# EAGLE design item_2022_Frontend_02_V7 (EAGLE 7.7.0)
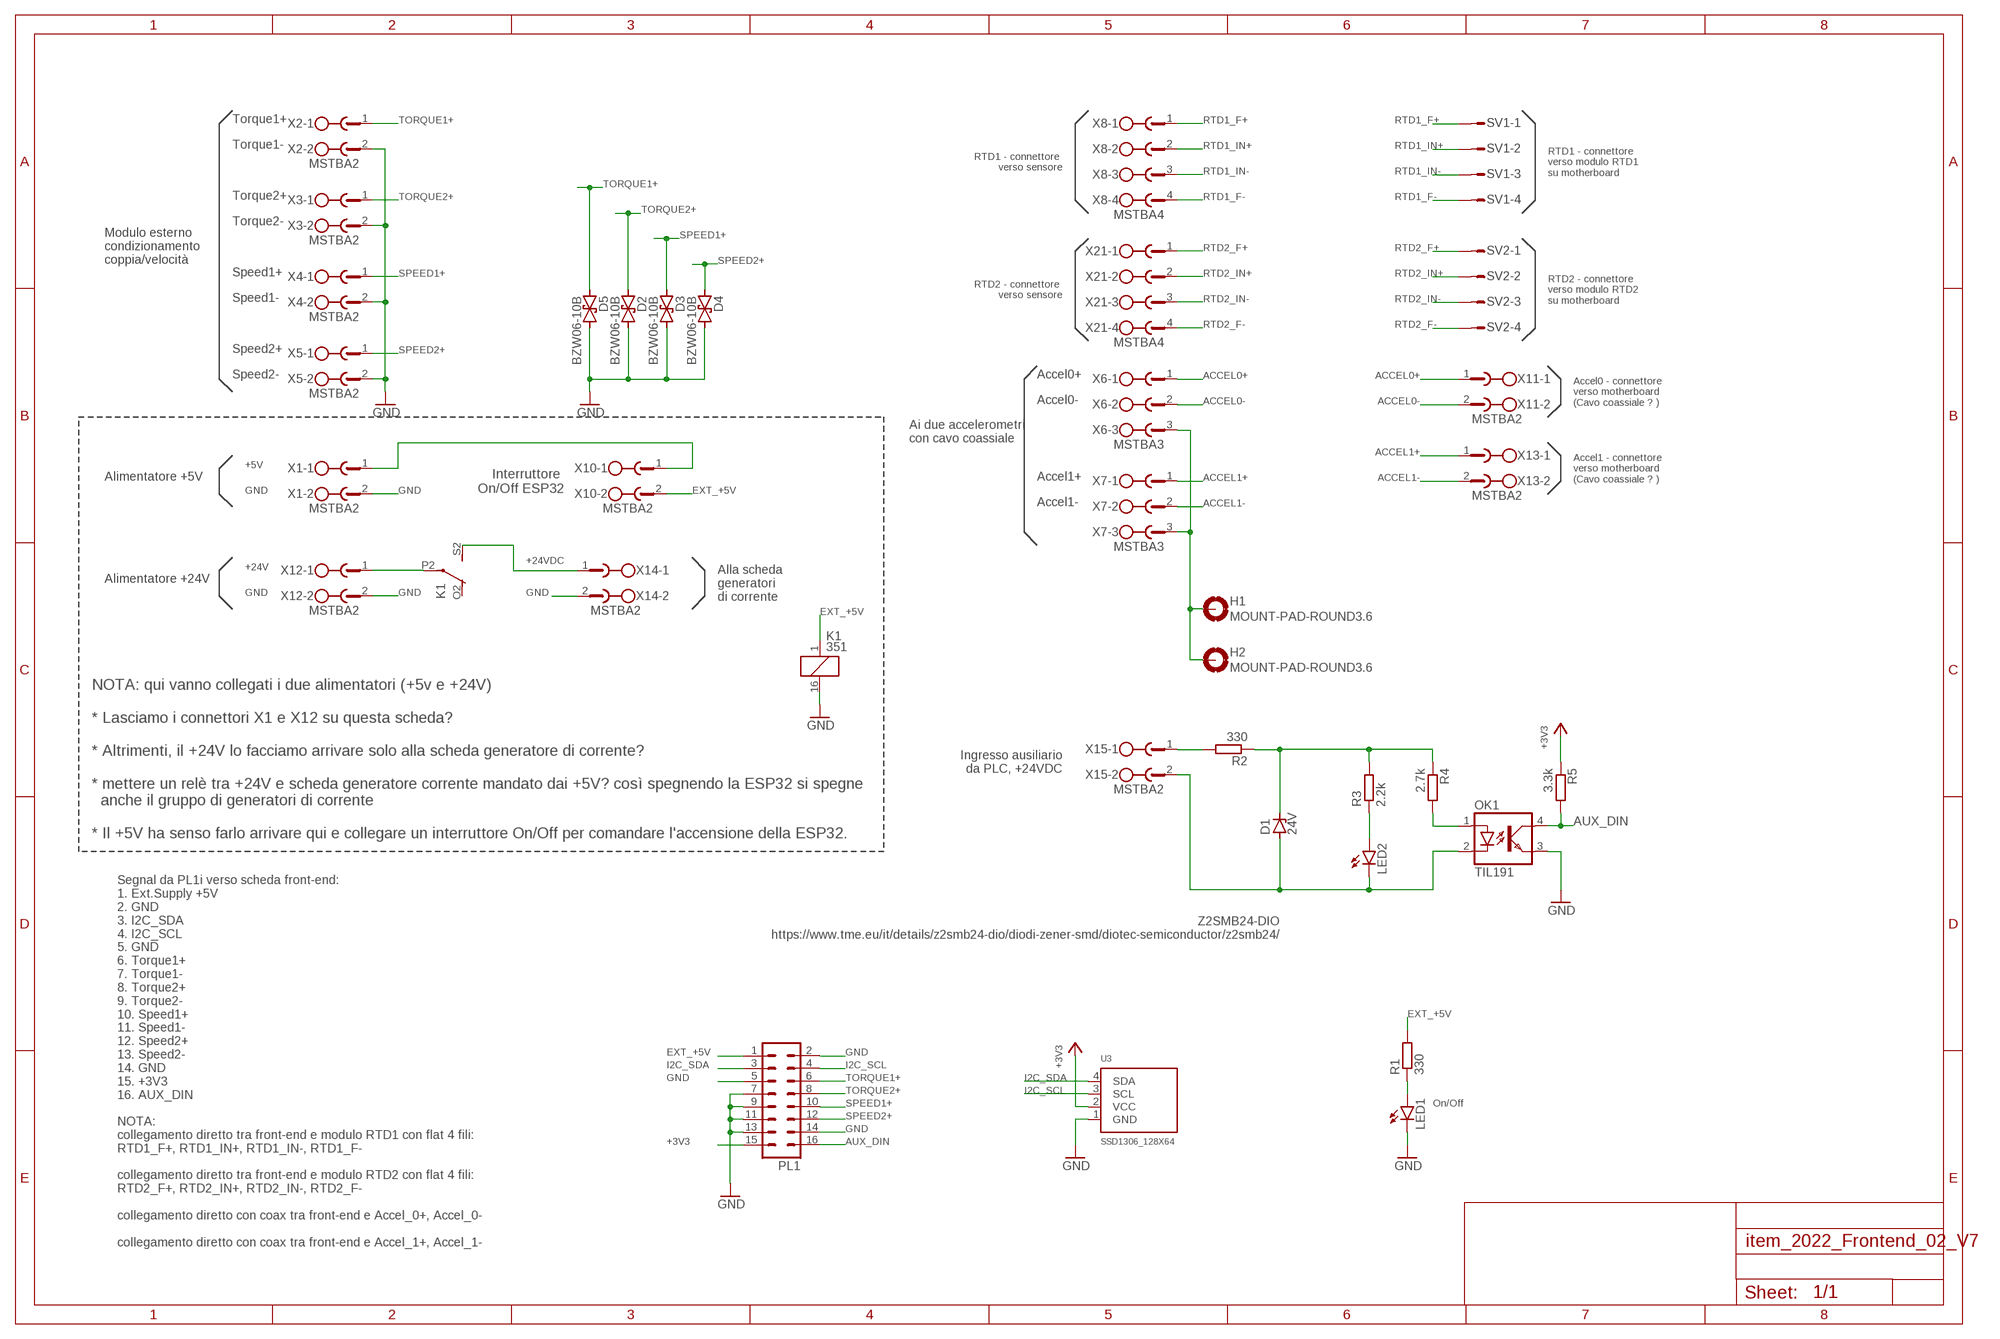
[diagram p0: schematic, sheet 1]

## Parts
D1  24V  ZENER-DIODEDO35Z10  [DO35Z10]
D2  BZW06-10B  BZW04XXB  [F126Z12]
D3  BZW06-10B  BZW04XXB  [F126Z12]
D4  BZW06-10B  BZW04XXB  [F126Z12]
D5  BZW06-10B  BZW04XXB  [F126Z12]
H1  MOUNT-PAD-ROUND3.6  [3,6-PAD]
H2  MOUNT-PAD-ROUND3.6  [3,6-PAD]
K1  351  [351]
LED1  LED5MM  [LED5MM]
LED2  LED5MM  [LED5MM]
OK1  TIL191  [DIL04]
PL1  16H  [16H]
R1  330  R-EU_R0805  [R0805]
R2  330  R-EU_R0805  [R0805]
R3  2.2k  R-EU_R0805  [R0805]
R4  2.7k  R-EU_R0805  [R0805]
R5  3.3k  R-EU_R0805  [R0805]
SV1  S04P  [S04P]
SV2  S04P  [S04P]
U3  SSD1306_128X64  [128X64]
X1  MSTBA2  [MSTBA2]
X2  MSTBA2  [MSTBA2]
X3  MSTBA2  [MSTBA2]
X4  MSTBA2  [MSTBA2]
X5  MSTBA2  [MSTBA2]
X6  MSTBA3  [MSTBA3]
X7  MSTBA3  [MSTBA3]
X8  MSTBA4  [MSTBA4]
X10  MSTBA2  [MSTBA2]
X11  MSTBA2  [MSTBA2]
X12  MSTBA2  [MSTBA2]
X13  MSTBA2  [MSTBA2]
X14  MSTBA2  [MSTBA2]
X15  MSTBA2  [MSTBA2]
X21  MSTBA4  [MSTBA4]

## Nets
+3V3: PL1.15 R5.1 U3.2(VCC)
+24VDC [Power]: K1.S2(3:S) X14.1
ACCEL0+ [Analog]: X6.1 X11.1
ACCEL0- [Analog]: X6.2 X11.2
ACCEL1+ [Analog]: X7.1 X13.1
ACCEL1- [Analog]: X7.2 X13.2
AUX_DIN: OK1.4(COL) PL1.16 R5.2
EXT_+5V [Power]: K1.1 PL1.1 R1.2 X10.2
GND: D2.C D3.C D4.C D5.C K1.16 LED1.K(C) OK1.3(EMIT) PL1.2 PL1.5 PL1.7 PL1.9 PL1.11 PL1.13 PL1.14 U3.1(GND) X1.2 X2.2 X3.2 X4.2 X5.2 X12.2 X14.2
I2C_SCL: PL1.4 U3.3(SCL)
I2C_SDA: PL1.3 U3.4(SDA)
N$1 [Analog]: R2.2 X15.1
N$2 [Power]: X1.1 X10.1
N$3: LED1.A R1.1
N$4 [Analog]: D1.C R2.1 R3.2 R4.1
N$5 [Analog]: D1.A LED2.K(C) OK1.2(C) X15.2
N$6 [Power]: K1.P2(3:P) X12.1
N$8 [Analog]: LED2.A R3.1
N$9 [Analog]: OK1.1(A) R4.2
PE [Power]: H1.B3,6(MOUNT) H2.B3,6(MOUNT) X6.3 X7.3
RTD1_F+ [Analog]: SV1.1 X8.1
RTD1_F- [Analog]: SV1.4 X8.4
RTD1_IN+ [Analog]: SV1.2 X8.2
RTD1_IN- [Analog]: SV1.3 X8.3
RTD2_F+ [Analog]: SV2.1 X21.1
RTD2_F- [Analog]: SV2.4 X21.4
RTD2_IN+ [Analog]: SV2.2 X21.2
RTD2_IN- [Analog]: SV2.3 X21.3
SPEED1+ [Analog]: D3.A PL1.10 X4.1
SPEED2+ [Analog]: D4.A PL1.12 X5.1
TORQUE1+ [Analog]: D5.A PL1.6 X2.1
TORQUE2+ [Analog]: D2.A PL1.8 X3.1
Unconnected: K1.O1(2:O) K1.O2(3:O) K1.P1(2:P) K1.S1(2:S)

## Notes on the sheet
- Torque1+
- Torque1-
- RTD1 - connettore 
  verso sensore
- RTD1 - connettore 
  verso modulo RTD1
  su motherboard
- Torque2+
- Torque2-
- Modulo esterno
  condizionamento
  coppia/velocità
- Speed1+
- RTD2 - connettore 
  verso sensore
- RTD2 - connettore 
  verso modulo RTD2
  su motherboard
- Speed1-
- Speed2+
- Speed2- | Accel0+
- Accel0 - connettore 
  verso motherboard
  (Cavo coassiale ? )
- Accel0-
- Ai due accelerometri
  con cavo coassiale
- +5V
- Accel1 - connettore 
  verso motherboard
  (Cavo coassiale ? )
- Alimentatore +5V
- Interruttore 
  On/Off ESP32
- Accel1+
- GND
- Accel1-
- +24V
- Alimentatore +24V
- Alla scheda 
  generatori
  di corrente
- GND
- Ingresso ausiliario
  da PLC, +24VDC
- NOTA: qui vanno collegati i due alimentatori (+5v e +24V)
  
  * Lasciamo i connettori X1 e X12 su questa scheda?
  
  * Altrimenti, il +24V lo facciamo arrivare solo alla scheda generatore di corrente?
  
  * mettere un relè tra +24V e scheda generatore corrente mandato dai +5V? così spegnendo la ESP32 si spegne
    anche il gruppo di generatori di corrente
  
  * Il +5V ha senso farlo arrivare qui e collegare un interruttore On/Off per comandare l'accensione della ESP32.
- Z2SMB24-DIO
  https://www.tme.eu/it/details/z2smb24-dio/diodi-zener-smd/diotec-semiconductor/z2smb24/
- On/Off
- Segnal da PL1i verso scheda front-end:
  1. Ext.Supply +5V
  2. GND
  3. I2C_SDA
  4. I2C_SCL
  5. GND
  6. Torque1+
  7. Torque1-
  8. Torque2+
  9. Torque2-
  10. Speed1+
  11. Speed1-
  12. Speed2+
  13. Speed2-
  14. GND
  15. +3V3
  16. AUX_DIN
  
  NOTA:
  collegamento diretto tra front-end e modulo RTD1 con flat 4 fili:
  RTD1_F+, RTD1_IN+, RTD1_IN-, RTD1_F-
  
  collegamento diretto tra front-end e modulo RTD2 con flat 4 fili:
  RTD2_F+, RTD2_IN+, RTD2_IN-, RTD2_F-
  
  collegamento diretto con coax tra front-end e Accel_0+, Accel_0-
  
  collegamento diretto con coax tra front-end e Accel_1+, Accel_1-

## Library data of the parts
D1 = diode:ZENER-DIODE: Z-Diode
D2-D5 = diode_LargePads:BZW04XXB: DIODE uni and bidirectional supressor diode
H1 H2 = holes:MOUNT-PAD-ROUND: MOUNTING PAD, round
K1 = relay:351: RELAY 2 x switch, Omron; OC_FARNELL: unknown; OC_NEWARK: unknown
LED1 LED2 = led:LED: LED OSRAM: - CHIPLED LG R971, LG N971, LY N971, LG Q971, LY Q971, LO R971, LY R971 LH N974, LH R974 LS Q976, LO Q976, LY Q976 LO Q996 - Hyper CHIPLED LW Q18S LB Q993, LB Q99A, LB R99A - SideLED LS A670, LO A670, LY A670, LG A670, LP A670 LB A673, LV A673, LT A673, LW A673 LH A674 LY A675 LS A676, LA A676, LO A676, LY A676, LW A676 LS A679, LY A679, LG A679 - Hyper Micro SIDELED® LS Y876, LA Y876, LO Y876, LY Y876 LT Y87S - SmartLED LW L88C, LW L88S LB L89C, LB L89S, LG L890 LS L89K, LO L89K, LY L89K LS L896, LA L896, LO L896, LY L896 - TOPLED LS T670, LO T670, LY T670, LG T670, LP T670 LSG T670, LSP T670, LSY T670, LOP T670, LYG T670 LG T671, LOG T671, LSG T671 LB T673, LV T673, LT T673, LW T673 LH T674 LS T676, LA T676, LO T676, LY T676, LB T676, LH T676, LSB T676, LW T676 LB T67C, LV T67C, LT T67C, LS T67K, LO T67K, LY T67K, LW E67C LS E67B, LA E67B, LO E67B, LY E67B, LB E67C, LV E67C, LT E67C LW T67C LS T679, LY T679, LG T679 LS T770, LO T770, LY T770, LG T770, LP T770 LB T773, LV T773, LT T773, LW T773 LH T774 LS E675, LA E675, LY E675, LS T675 LS T776, LA T776, LO T776, LY T776, LB T776 LHGB T686 LT T68C, LB T68C - Hyper Mini TOPLED® LB M676 - Mini TOPLED Santana® LG M470 LS M47K, LO M47K, LY M47K Source: http://www.osram.convergy.de LUXEON: - LUMILED® LXK2-PW12-R00, LXK2-PW12-S00, LXK2-PW14-U00, LXK2-PW14-V00 LXK2-PM12-R00, LXK2-PM12-S00, LXK2-PM14-U00 LXK2-PE12-Q00, LXK2-PE12-R00, LXK2-PE12-S00, LXK2-PE14-T00, LXK2-PE14-U00 LXK2-PB12-K00, LXK2-PB12-L00, LXK2-PB12-M00, LXK2-PB14-N00, LXK2-PB14-P00, LXK2-PB14-Q00 LXK2-PR12-L00, LXK2-PR12-M00, LXK2-PR14-Q00, LXK2-PR14-R00 LXK2-PD12-Q00, LXK2-PD12-R00, LXK2-PD12-S00 LXK2-PH12-R00, LXK2-PH12-S00 LXK2-PL12-P00, LXK2-PL12-Q00, LXK2-PL12-R00 Source: www.luxeon.com KINGBRIGHT: KA-3528ASYC Source: www.kingbright.com
OK1 = optocoupler:TIL191: TEXAS INSTRUMENTS OPTO COUPLER; OC_FARNELL: 1683363; OC_NEWARK: unknown
PL1 = con-harting-h:16H: CONNECTOR; OC_FARNELL: unknown; OC_NEWARK: unknown
R1-R5 = rcl:R-EU_: RESISTOR, European symbol; SPICEPREFIX: R
SV1 SV2 = con-amp-mt:S04P: AMP MT CONNECTOR; OC_FARNELL: unknown; OC_NEWARK: unknown
U3 = ssd1306oled:SSD1306_128X64: OLED Display Board 0.91" 128x64 White I2C - 4 Pins - SSD1306
X1-X5 X10-X15 = con-phoenix-508:MSTBA2: PHOENIX; MF: FARNELL; MPN: 1757242; OC_FARNELL: 3705171; OC_NEWARK: 71C4161
X6 X7 = con-phoenix-508:MSTBA3: PHOENIX; MF: FARNELL; MPN: 1757255; OC_FARNELL: 3705183; OC_NEWARK: 71C4162
X8 X21 = con-phoenix-508:MSTBA4: PHOENIX; MF: FARNELL; MPN: 1757268; OC_FARNELL: 3705195; OC_NEWARK: 71C4163

## Net classes
0 default: width 0.406 mm, drill 0.305 mm, clearance 0.406 mm
1 Power: width 1.397 mm, drill 0.305 mm, clearance 0.406 mm
2 Analog: width 0.889 mm, drill 0.305 mm, clearance 0.406 mm

## Board
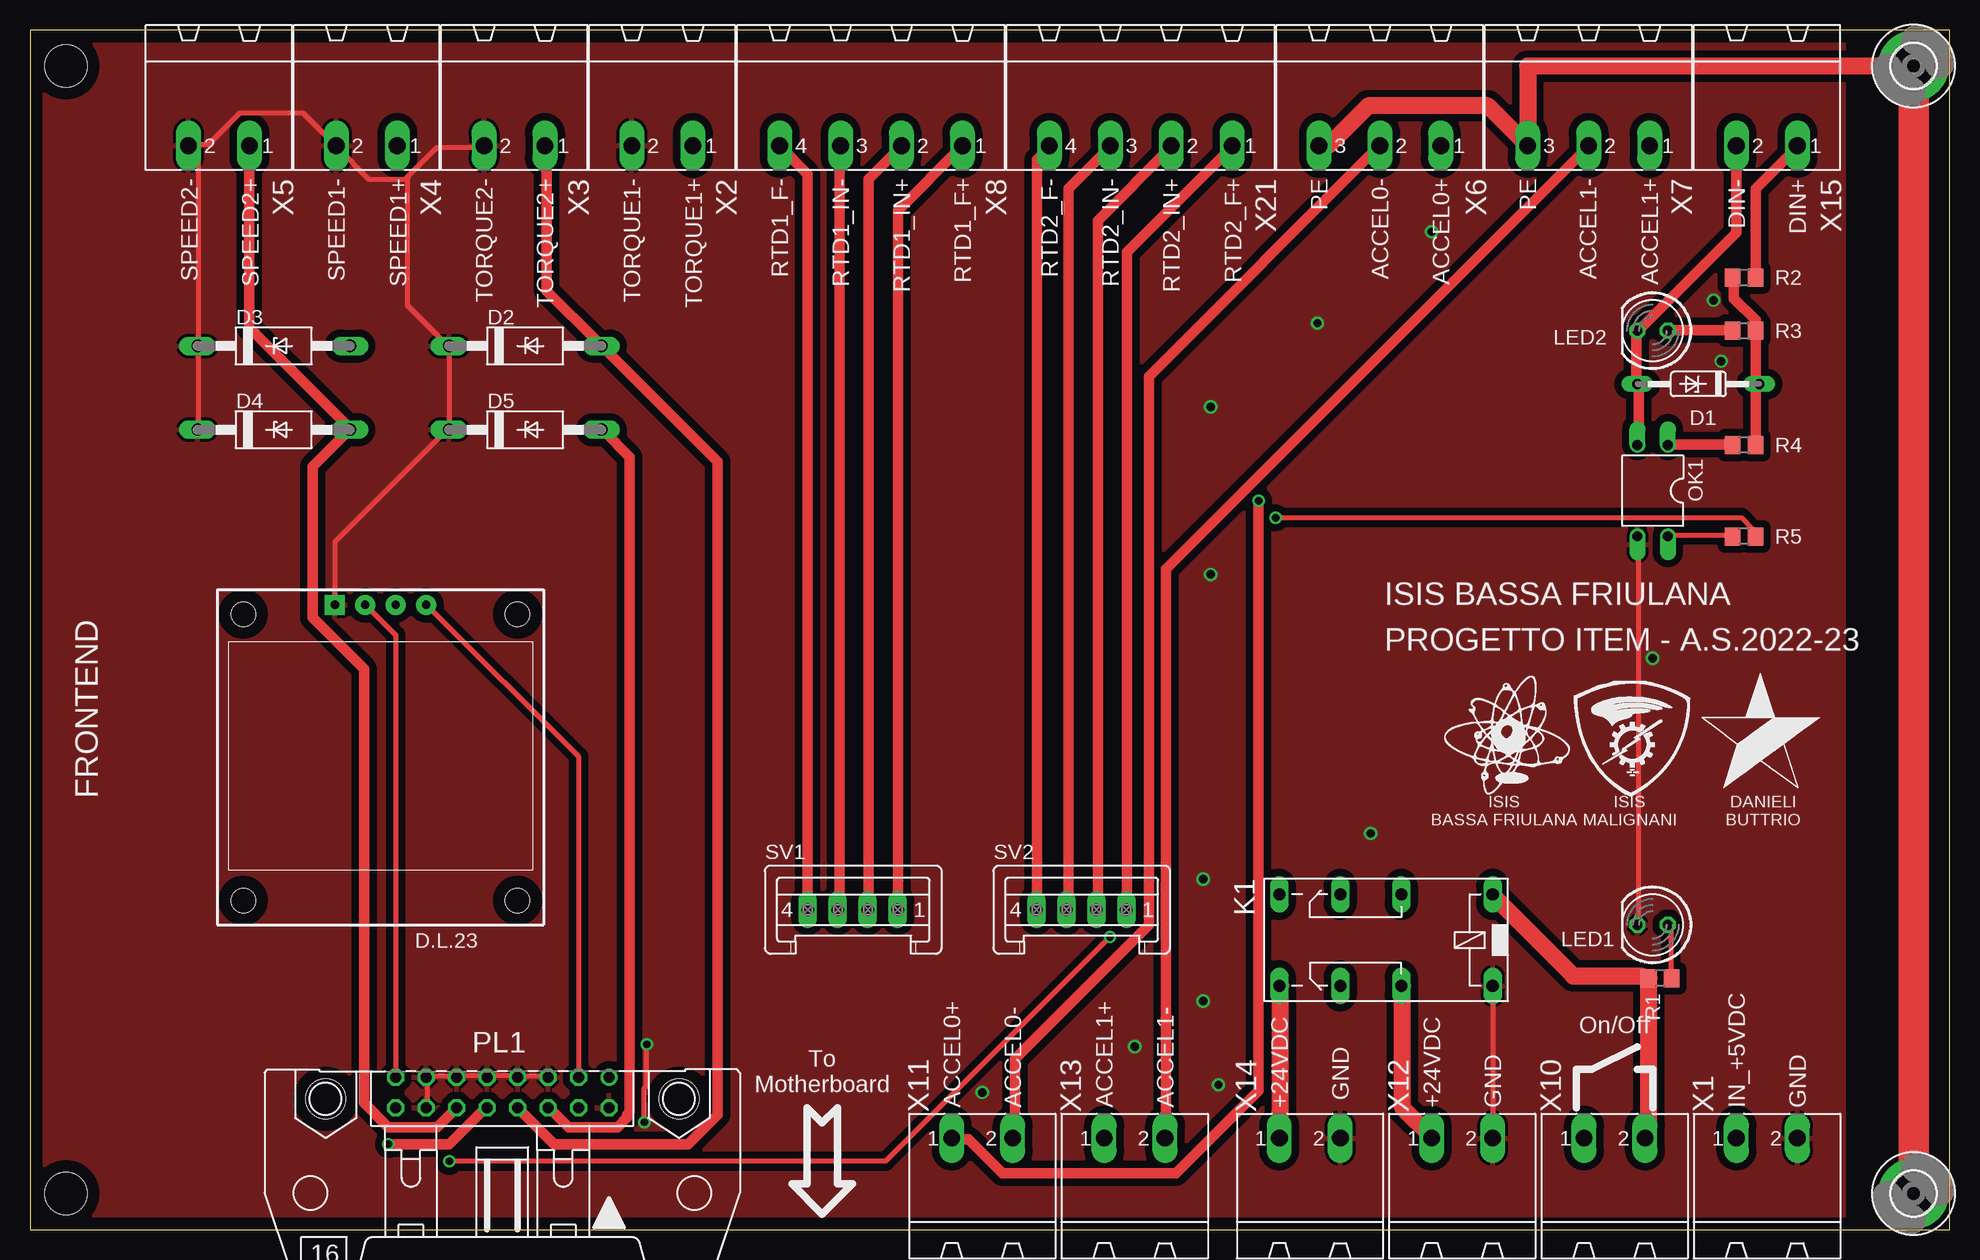
[diagram p1: board, top side]
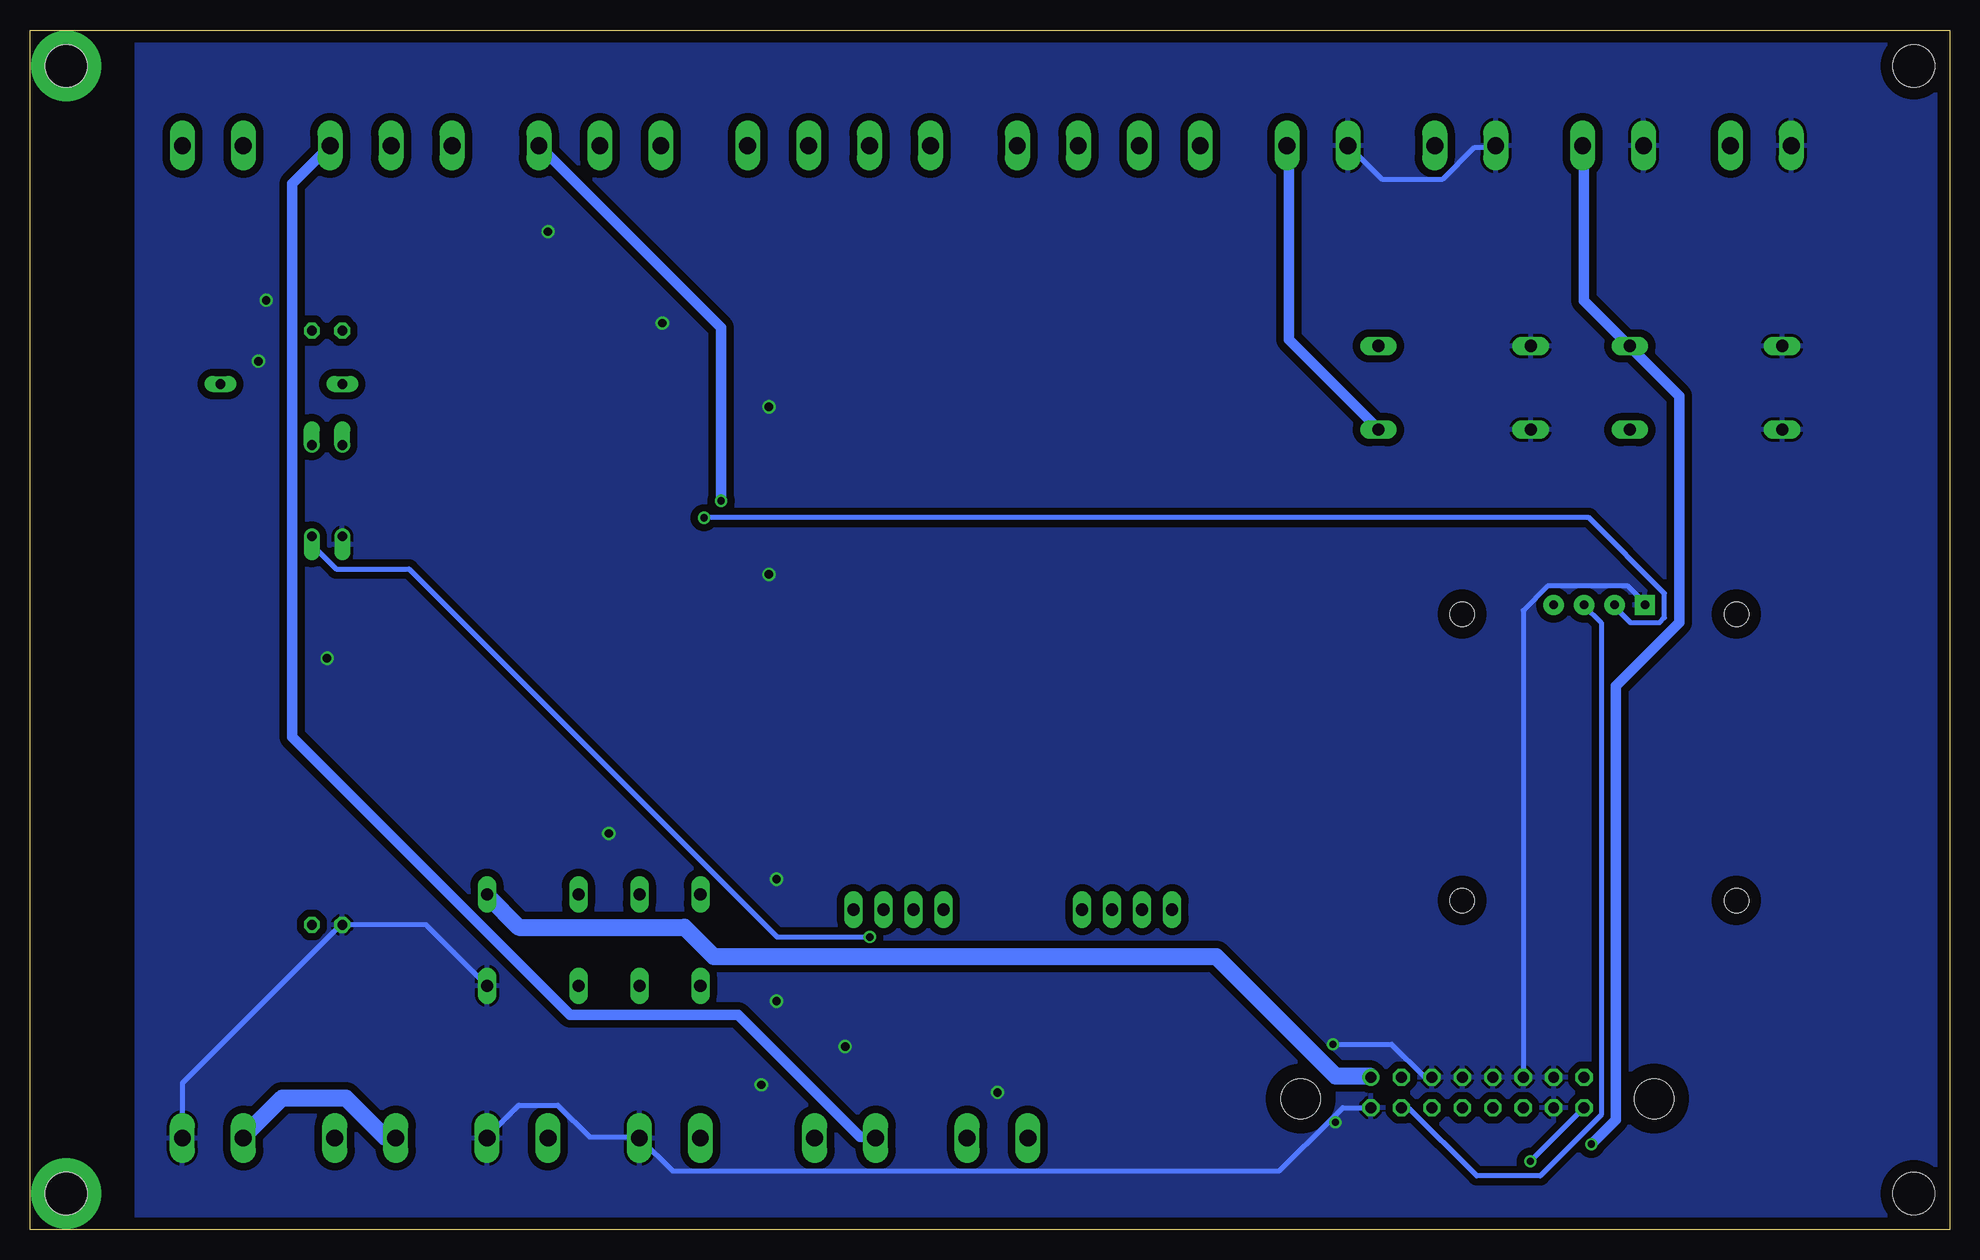
[diagram p2: board, bottom side, seen from below]

Size 160.02 x 100 mm. Coordinates in mm from the lower left corner, seen from the top.
Outline: 160,0 0,0 0,100 160,100
Outline: 160.02,0 160.02,100
Copper layers (1*16): Top 0.035mm / dielectric 1.5mm / Bottom 0.035mm
Design rules "default": minimum track width 10mil, minimum drill 24mil, track to track 8mil, track to pad 8mil, pad to pad 8mil, via to via 8mil, smd to smd 8mil, copper to edge 40mil, drill to drill 8mil, minimum pad ring 10mil, minimum via ring 8mil, stop-mask expansion 4mil, vias tented up to drill 0mil, thermal gap 10mil
Holes 3.5 mm at 3,3 3,97 157,97 157,3
tKeepout: area -3.2,99.1 to 163.2,102.9; area 159.4,-2.5 to 163.8,99.1; area -3.8,-1.9 to 0.6,99.1; area 0.6,-3.2 to 159.4,0.6
bKeepout: area -3.2,99.1 to 163.2,102.9; area 159.4,-2.5 to 163.8,99.1; area 0.6,-3.2 to 159.4,0.6; area -3.8,-1.9 to 0.6,99.1

### Footprints (pad centres in the part's own frame; a part is rotated, then mirrored left to right if it is on the bottom)
DO35Z10 = drill 0.813 long: A 5.08,0; C -5.08,0
F126Z12 = drill 1.016 long: A 6.35,0; C -6.35,0
3,6-PAD = drill 3.6 pad 5.842: B3,6 0,0
351 = drill 1.016 long: 1 -3.81,-3.81; 16 -3.81,3.81; O1 8.89,-3.81; O2 8.89,3.81; P1 3.81,-3.81; P2 3.81,3.81; S1 13.97,-3.81; S2 13.97,3.81
LED5MM = drill 0.813 octagon: A -1.27,0; K 1.27,0
DIL04 = drill 0.813 offset: 1 -1.27,-3.81; 2 1.27,-3.81; 3 1.27,3.81; 4 -1.27,3.81
16H = drill 0.914: 1 -8.89,-1.27 | drill 0.914 octagon: 2 -8.89,1.27; 3 -6.35,-1.27; 4 -6.35,1.27; 5 -3.81,-1.27; 6 -3.81,1.27; 7 -1.27,-1.27; 8 -1.27,1.27; 9 1.27,-1.27; 10 1.27,1.27; 11 3.81,-1.27; 12 3.81,1.27; 13 6.35,-1.27; 14 6.35,1.27; 15 8.89,-1.27; 16 8.89,1.27 | hole 3.302: -14.732,0.533; 14.732,0.533
R0805 = smd 1.3 x 1.5: 1 -0.95,0; 2 0.95,0
S04P = drill 1.016 long: 1 3.75,0; 2 1.25,0; 3 -1.25,0; 4 -3.75,0
128X64 = drill 0.7 pad 1.676 square: 1 -3.81,12.7 | drill 0.7 pad 1.676: 2 -1.27,12.7; 3 1.27,12.7; 4 3.81,12.7 | hole 2.032: -11.43,11.938; -11.43,-11.938; 11.43,11.938; 11.43,-11.938
MSTBA2 = drill 1.397 long: 1 -2.54,5.08; 2 2.54,5.08
MSTBA3 = drill 1.397 long: 1 -5.08,5.08; 2 0,5.08; 3 5.08,5.08
MSTBA4 = drill 1.397 long: 1 -7.62,5.08; 2 -2.54,5.08; 3 2.54,5.08; 4 7.62,5.08

### Placement (x,y rotation side)
D1  139.06,70.48 180 top
D2  41.27,73.66 0 top
D3  20.32,73.66 0 top
D4  20.32,66.67 0 top
D5  41.27,66.67 0 top
H1  157,97 0 top
H2  157,3 0 top
K1  118.11,24.13 180 top
LED1  135.25,25.4 180 top
LED2  135.25,74.93 180 top
OK1  135.25,61.59 180 top
PL1  39.37,11.43 180 top
R1  135.89,20.95 180 top
R2  142.88,79.38 0 top
R3  142.88,74.93 0 top
R4  142.88,65.41 180 top
R5  142.88,57.78 180 top
SV1  68.58,26.67 0 top
SV2  87.63,26.67 0 top
U3  29.21,39.37 0 top
U$1  [BASSA]  117.16,35.88 0 top
U$2  [UDINE]  128.27,35.88 0 top
U$3  [DANIELI]  139.06,36.83 0 top
X1  144.78,2.54 0 top
X2  52.7,95.44 180 top
X3  40.39,95.44 180 top
X4  28.07,95.44 180 top
X5  15.75,95.44 180 top
X6  112.52,95.44 180 top
X7  129.92,95.44 180 top
X8  70.1,95.44 180 top
X10  132.08,2.54 0 top
X11  79.38,2.54 0 top
X12  119.38,2.54 0 top
X13  92.08,2.54 0 top
X14  106.68,2.54 0 top
X15  144.78,95.44 180 top
X21  92.58,95.44 180 top

### Tracks (layer width: path | path; a pad name or v marks a point on that pad's centre or on a via)
+3V3  (via drill 0.61)
  Top 0.406: v103.83,59.33 142.65,59.33 143.66,58.32 143.66,57.91 R5.1 | PL1.15 30.48,49.58 28.04,52.02 U3.2
  Bottom 0.406: v103.83,59.33 30.07,59.33 23.77,53.03 23.77,51 24.18,50.6 26.62,50.6 28.04,52.02 U3.2
+24VDC
  Top 1.397: K1.S2 104.24,20.32 104.24,7.72 X14.1
ACCEL0+  (via drill 0.61)
  Top 0.889: v102.41,60.76 102.41,11.58 95.5,4.67 81.08,4.67 78.23,7.52 77.01,7.52 X11.1
  Bottom 0.889: v102.41,60.76 102.41,75.18 117.45,90.22 X6.1
ACCEL0-
  Top 0.889: X11.2 82.09,7.72 82.09,14.22 93.27,25.4 93.27,71.12 112.37,90.22 X6.2
ACCEL1+
  Bottom 0.889: X13.1 89.61,7.72 90.83,7.72 100.99,17.88 115.01,17.88 138.18,41.05 138.18,87.17 135.13,90.22 X7.1
ACCEL1-
  Top 0.889: X13.2 94.69,7.72 94.69,55.07 129.84,90.22 X7.2
AUX_DIN  (via drill 0.61)
  Top 0.406: R5.2 141.83,57.91 136.55,57.91 OK1.4 | v34.95,5.69 71.32,5.69 v90.02,24.38
  Bottom 0.406: v34.95,5.69 PL1.16 | v90.02,24.38 97.74,24.38 128.42,55.07 134.52,55.07 136.35,56.9 136.35,57.71 OK1.4
EXT_+5V
  Top 1.397: X10.2 134.93,7.92 134.93,20.93 R1.2 134.31,21.13 128.63,21.13 121.92,27.84 K1.1
  Bottom 1.397: PL1.1 48.36,12.8 51.21,12.8 61.16,22.76 103.02,22.76 105.46,25.2 119.28,25.2 121.92,27.84 K1.1
GND  (via drill 0.61, 0.7)
  Top 0.406: D4.C 14.02,66.85 14.02,73.56 D3.C 14.02,73.76 14.02,90.42 | 14.02,90.42 14.83,90.42 17.48,93.07 22.76,93.07 25.4,90.42 X4.2 25.6,90.22 28.25,87.58 31.29,87.58 31.39,87.68 | 14.02,90.42 13.21,90.42 X5.2 14.02,90.42 | 31.39,87.68 33.93,90.22 37.8,90.22 X3.2 | PL1.14 33.12,10.16 33.12,12.6 PL1.13 33.12,12.8 35.56,12.8 | 40.64,12.8 38.2,12.8 PL1.9 38,12.8 35.56,12.8 | 40.64,12.8 43.08,12.8 PL1.5 | 40.64,12.8 PL1.7 | 35.56,12.8 PL1.11 | U3.1 25.4,57.3 34.75,66.65 D5.C 34.95,66.85 34.95,73.56 D2.C 34.75,73.76 31.5,77.01 31.5,87.58 31.39,87.68 | OK1.3 134.11,57.71 134.11,25.4 LED1.K | K1.16 X12.2 | v51.41,15.44 51.41,11.99 51.21,11.79 v51.21,8.94
  Bottom 0.406: X3.2 38,90.22 39.62,90.22 42.27,87.58 47.35,87.58 49.99,90.22 X2.2 | PL1.11 35.56,51.61 33.53,53.65 26.82,53.65 25.4,52.22 U3.1 | PL1.2 50.6,10.16 51.51,9.25 | 51.51,9.25 55.88,4.88 106.48,4.88 X14.2 109.32,7.72 113.39,7.72 116.03,10.36 119.28,10.36 121.92,7.72 X12.2 | K1.16 127,25.4 LED1.K 134.11,25.4 147.32,12.19 X1.2 | v51.41,15.44 46.53,15.44 43.89,12.8 43.28,12.8 PL1.5 | 51.51,9.25 v51.21,8.94
  other vias: 116.84,83.19 107.31,75.56 98.42,68.58 98.42,54.61 97.79,29.21 97.79,19.05 99.06,12.06 92.08,15.24 111.76,33.02 135.25,47.62 79.38,11.43 140.34,77.47 140.97,72.39
  pour Top (isolate 0.61): -8.89,104.14 151.13,104.14 151.13,-5.71 -8.89,-5.71
  pour Bottom (isolate 0.61): -8.89,105.41 151.13,105.41 151.13,-5.08 -8.89,-5.08
I2C_SCL
  Bottom 0.406: PL1.4 45.11,10.16 39.42,4.47 34.14,4.47 29.06,9.55 29.06,50.6 30.48,52.02 U3.3
I2C_SDA
  Top 0.406: PL1.3 45.72,39.42 33.12,52.02 U3.4
N$1
  Top 0.889: R2.2 143.87,79.45 143.87,86.77 147.32,90.22 X15.1
N$2
  Bottom 1.397: X10.1 129.64,7.72 130.45,7.72 133.71,10.97 138.99,10.97 142.24,7.72 X1.1
N$3
  Top 0.406: R1.1 136.75,21.13 136.75,25.2 136.55,25.4 LED1.A
N$4
  Top 0.889: R4.1 143.87,65.43 143.87,70.1 144.07,70.31 D1.C 143.87,70.71 143.87,74.78 R3.2 143.87,75.39 143.87,75.79 142.04,77.62 142.04,79.25 R2.1
N$5
  Top 0.889: OK1.2 134.11,65.43 134.11,70.31 D1.A 133.91,70.92 133.91,74.78 LED2.K 134.31,75.18 142.24,83.11 X15.2
N$6
  Top 1.397: K1.P2 114.4,20.32 114.4,10.16 116.84,7.72 X12.1
N$8
  Top 0.889: R3.1 141.83,74.98 136.55,74.98 LED2.A
N$9
  Top 0.889: R4.2 141.83,65.43 136.55,65.43 OK1.1
PE
  Top 1.397: X6.3 107.49,90.42 108.31,90.42 111.56,93.67 121.51,93.67 124.77,90.42 X7.3
  Top 1.422: H1.B3,6 124.84,97 X7.3
  Top 2.54: H2.B3,6 H1.B3,6
RTD1_F+
  Top 0.889: SV1.1 72.34,26.82 72.34,84.94 77.62,90.22 X8.1
RTD1_F-
  Top 0.889: SV1.4 64.82,26.82 64.82,87.99 62.59,90.22 X8.4
RTD1_IN+
  Top 0.889: SV1.2 69.9,26.82 69.9,87.58 72.54,90.22 X8.2
RTD1_IN-
  Top 0.889: SV1.3 67.46,26.82 67.46,90.22 X8.3
RTD2_F+
  Top 0.889: SV2.1 91.44,26.82 91.44,81.48 100.18,90.22 X21.1
RTD2_F-
  Top 0.889: SV2.4 83.92,26.82 83.92,89.2 84.94,90.22 X21.4
RTD2_IN+
  Top 0.889: SV2.2 89,26.82 89,84.12 95.1,90.22 X21.2
RTD2_IN-
  Top 0.889: SV2.3 86.56,26.82 86.56,86.77 90.02,90.22 X21.3
SPEED1+  (via drill 0.61)
  Top 0.889: v29.87,7.11 34.95,7.11 38,10.16 PL1.10
  Bottom 0.889: v29.87,7.11 27.84,9.14 27.84,45.31 22.55,50.6 22.55,69.49 26.62,73.56 D3.A 27.03,73.97 30.48,77.42 30.48,90.22 X4.1
SPEED2+
  Top 0.889: PL1.12 33.93,8.53 29.87,8.53 27.84,10.57 27.84,46.74 23.57,51 23.57,63.6 26.62,66.65 D4.A 26.42,67.06 18.29,75.18 X5.1
TORQUE1+
  Top 0.889: PL1.6 43.28,10.16 44.91,8.53 48.97,8.53 49.78,9.35 49.78,9.55 49.99,9.75 49.99,64.41 47.75,66.65 D5.A
  Bottom 0.889: X2.1 55.07,90.22 55.07,74.17 47.75,66.85 D5.A
TORQUE2+
  Top 0.889: PL1.8 43.69,7.11 54.86,7.11 57.3,9.55 57.3,64.01 47.75,73.56 D2.A 47.35,73.97 43.08,78.23 43.08,90.22 X3.1

### Text on the board
tPlace: ISIS / BASSA FRIULANA | ISIS / MALIGNANI | DANIELI / BUTTRIO | D.L.23
tNames: SPEED2- | SPEED2+ | SPEED1- | SPEED1+ | TORQUE2- | TORQUE2+ | TORQUE1- | TORQUE1+ | RTD1_F- | RTD1_IN- | RTD1_IN+ | RTD1_F+ | RTD2_F- | RTD2_IN- | RTD2_IN+ | RTD2_F+ | PE | ACCEL0- | ACCEL0+ | PE | ACCEL1- | ACCEL1+ | DIN- | DIN+ | ISIS BASSA FRIULANA | PROGETTO ITEM - A.S.2022-23 | FRONTEND | On/Off | To / Motherboard | GND | ACCEL0+ | ACCEL0- | ACCEL1+ | ACCEL1- | +24VDC | +24VDC | GND | IN_+5VDC | GND